# EAGLE design 4T-audio-amp (EAGLE 5.07)
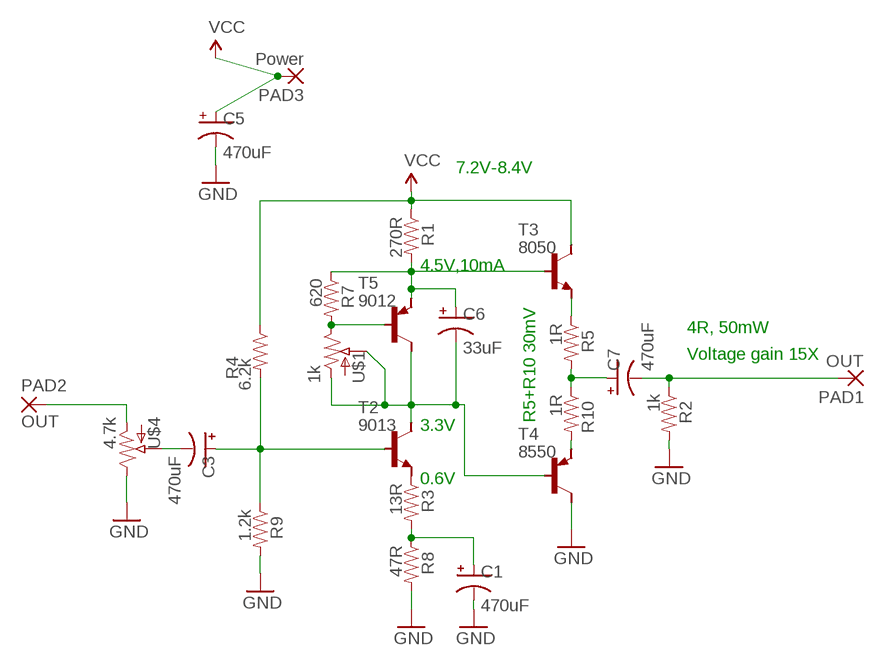
[diagram p0: schematic, sheet 1]

## Parts
C1  470uF  CAP_POLPTH1  [CPOL-RADIAL-100UF-25V]
C3  470uF  CAP_POLPTH1  [CPOL-RADIAL-100UF-25V]
C5  470uF  CAP_POLPTH1  [CPOL-RADIAL-100UF-25V]
C6  33uF  CAP_POLPTH1  [CPOL-RADIAL-100UF-25V]
C7  470uF  CAP_POLPTH1  [CPOL-RADIAL-100UF-25V]
PAD1  OUT  WIREPAD4,16O1,6  [4,16O1,6]
PAD2  OUT  WIREPAD4,16O1,6  [4,16O1,6]
PAD3  Power  WIREPAD4,16O1,6  [4,16O1,6]
R1  270R  RESISTOR0805  [0805]
R2  1k  RESISTOR0805  [0805]
R3  13R  RESISTOR1/4W  [AXIAL-0.3]
R4  6.2k  RESISTOR0805  [0805]
R5  1R  RESISTOR0805  [0805]
R7  620  RESISTOR0805  [0805]
R8  47R  RESISTOR0805  [0805]
R9  1.2k  RESISTOR0805  [0805]
R10  1R  RESISTOR0805  [0805]
T2  9013  -NPN-TO92-EBC  [TO92-EBC]
T3  8050  -NPN-TO92-EBC  [TO92-EBC]
T4  8550  -PNP-TO92-EBC  [TO92-EBC]
T5  9012  -PNP-TO92-EBC  [TO92-EBC]
U$1  1k  POTB25P-3362P  [B25P]
U$4  4.7k  POTPANNEL  [POT-PANNEL]

## Nets
GND: C1.2(-) C5.2(-) R2.2 R8.2 R9.2 T4.C U$4.E
N$1: R10.2 T4.E
N$2: R3.P$1 T2.E
N$3: C6.2(-) T2.C T4.B T5.C U$1.A U$1.S
N$4: C7.1(+) R5.2 R10.1
N$5: R5.1 T3.E
N$6: C1.1(+) R3.P$2 R8.1
N$7: R7.2 T5.B U$1.E
N$8: C6.1(+) R1.2 R7.1 T3.B T5.E
N$9: C7.2(-) PAD1.1(P) R2.1
N$10: C3.1(+) R4.2 R9.1 T2.B
N$11: PAD2.1(P) U$4.A
N$12: C3.2(-) U$4.S
VCC: C5.1(+) PAD3.1(P) R1.1 R4.1 T3.C

## Notes on the sheet
- 7.2V-8.4V
- 4.5V,10mA
- 4R, 50mW
- Voltage gain 15X
- R5+R10 30mV
- 3.3V
- 0.6V

## Library data of the parts
C1 C3 C5-C7 = digital-toy:CAP_POL: Capacitor Polarized These are standard SMD and PTH capacitors. Normally 10uF, 47uF, and 100uF in electrolytic and tantalum varieties. Always verify the external diameter of the through hole cap, it varies with capacity, voltage, and manufacturer. The EIA devices should be standard. PANASONIC_D size: 6.5mmx6.5mmx5.5mm, 100uf (taobao:6.3mmx5.5mm), same as CVL0605 153cvl0405 size: 4mmx4mmx5.5mm, 10uf (taobao:4mmx5.5mm) ct6032 typical 47uF Tantalum, comment by hyl.
PAD1-PAD3 = wirepad:WIREPAD: Wire PAD connect wire on PCB
R1-R5 R7-R10 = digital-toy:RESISTOR: Resistor Basic schematic elements and footprints for 0603, 1206, and PTH 1/10th watt (small) resistors. digital-toy copy vertical mount of axial-0.3 from rcl.lbr : the 0207/xx 3W resistor: 0617/17, 0617/22, 0617V
T2 T3 = digital-toy:*-NPN-: NPN Transistror most of sot-23 use the pacages sot23-BEC, top C, left B, right E. by hyl, digital-toy. and to-92 use ebc(from-top) by hyl, digital-toy.
T4 T5 = digital-toy:*-PNP-: PNP Transistror
U$1 U$4 = digital-toy:POT: POT digital toy POT, 3296 multi turn, blue-white ... hyl 8/07/2001

## Board
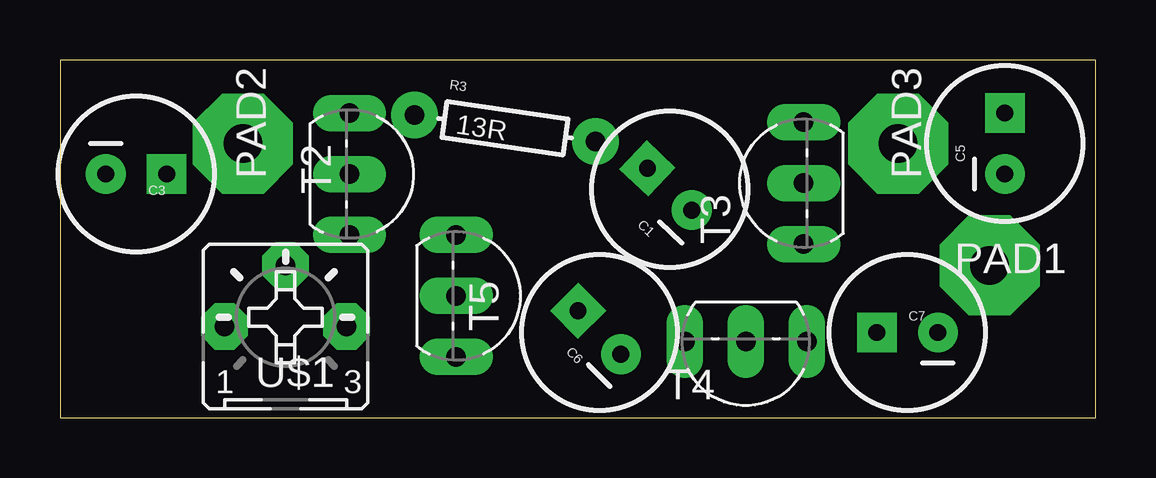
[diagram p1: board, top side]
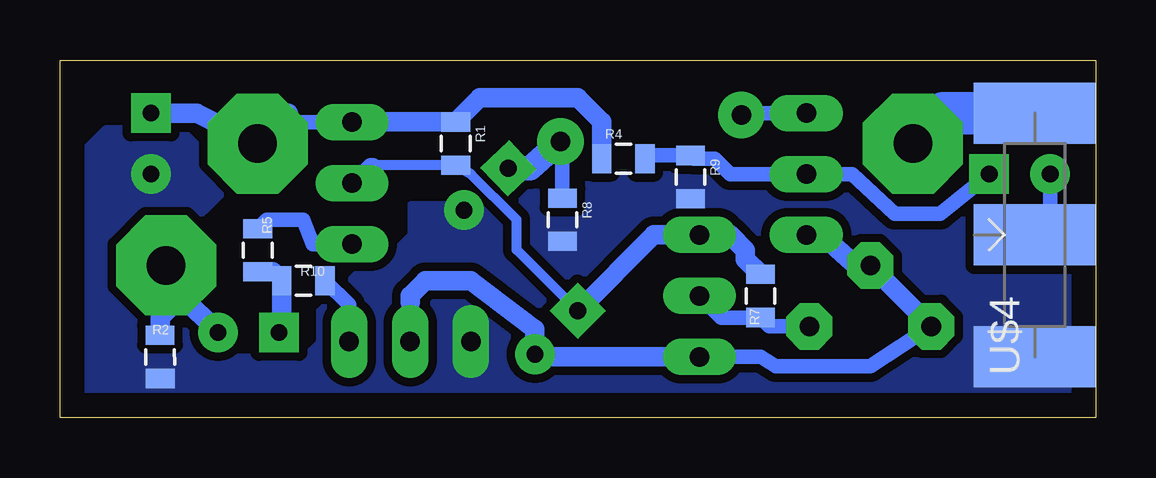
[diagram p2: board, bottom side, seen from below]

Size 43.16 x 14.91 mm. Coordinates in mm from the lower left corner, seen from the top.
Outline: 0,0 43.16,0 43.16,14.91 0,14.91 0,0
Copper layers (1*16): Top 0.035mm / dielectric 1.5mm / Bottom 0.035mm
Design rules "default": minimum track width 10mil, minimum drill 24mil, track to track 8mil, track to pad 8mil, pad to pad 8mil, via to via 8mil, smd to smd 8mil, copper to edge 40mil, drill to drill 8mil, minimum pad ring 10mil, minimum via ring 8mil, stop-mask expansion 4mil, vias tented up to drill 0mil, thermal gap 10mil

### Footprints (pad centres in the part's own frame; a part is rotated, then mirrored left to right if it is on the bottom)
CPOL-RADIAL-100UF-25V = drill 0.7 pad 1.651 square: 1 1.27,0 | drill 0.7 pad 1.651 round: 2 -1.27,0
4,16O1,6 = drill 1.6 pad 4.166 octagon: 1 0,0
0805 = smd 0.8 x 1.2: 1 -0.9,0; 2 0.9,0
AXIAL-0.3 = drill 0.813 pad 1.93 round: P$1 -3.81,0; P$2 3.81,0
TO92-EBC = drill 0.813 pad 1.524 long: B 0,-1.27; C 2.54,-1.27; E -2.54,-1.27
B25P = drill 0.813 pad 1.93 octagon: A -2.54,0; E 2.54,0; S 0,2.54
POT-PANNEL = smd 2.54 x 5.08: A -6.35,0; E 3.81,0; S -1.27,0

### Placement (x,y rotation side)
C1  25.4,9.53 136.6 top
C3  3.17,10.16 0 top
C5  39.37,11.43 90 top
C6  22.48,3.56 134.6 top
C7  35.31,3.56 180 top
PAD1  38.73,6.35 0 top
PAD2  7.62,11.43 0 top
PAD3  34.92,11.43 0 top
R1  26.67,11.43 270 bottom
R2  38.99,2.54 270.2 bottom
R3  18.54,12.06 351.7 top
R4  19.68,10.79 0 bottom
R5  34.92,6.99 270 bottom
R7  13.97,5.08 270 bottom
R8  22.23,8.26 270 bottom
R9  16.89,10.03 270 bottom
R10  33.02,5.71 0 bottom
T2  13.34,10.16 270 top
T3  29.72,9.78 90 top
T4  28.57,1.91 180 top
T5  17.78,5.08 270 top
U$1  9.4,3.81 0 top
U$4  2.54,6.35 270 bottom

### Tracks (layer width: path | path; a pad name or v marks a point on that pad's centre or on a via)
GND
  pour Bottom (isolate 0.356, no thermals): -2.54,7.62 5.08,7.62 5.71,8.89 9.53,8.89 10.79,10.16 22.86,10.16 24.13,8.89 28.57,8.89 28.57,7.62 29.84,6.35 30.48,6.35 32.38,4.45 32.38,3.17 33.02,2.54 36.83,2.54 38.1,3.81 38.1,7.62 36.2,9.53 36.2,10.16 38.1,12.06 41.27,12.06 45.09,8.26 45.09,1.27 41.91,-1.91 -0.64,-1.91 -2.54,0
N$1
  Bottom 0.61: T4.E 31.11,4.71 R10.2
N$2
  Bottom 0.61: T2.E 14.85,12.7 R3.P$1
N$3
  Bottom 0.254: 23.26,2.54 C6.2
  Bottom 0.61: T5.C 13.97,2.54 13.34,2.16 9.4,2.16 U$1.A | 28.57,4.83 T4.B
  Bottom 0.813: T2.C 11.43,7.62 10.16,6.48 U$1.S U$1.A | T5.C 23.26,2.54 | C6.2 23.37,3.69 26.04,5.71 27.94,5.71 28.57,5.08 28.57,4.83
N$4
  Bottom 0.254: R10.1 34.29,6.08
  Bottom 0.813: 34.29,6.08 R5.2 | R10.1 33.92,4.31 C7.1
N$5
  Bottom 0.61: T3.E 32.64,7.24 33.02,8.26 34.55,8.26 R5.1
N$6
  Bottom 0.61: R8.1 22.23,10.79 R3.P$2
  Bottom 1.016: C1.1 23.56,10.4 R3.P$2
N$7
  Bottom 0.61: U$1.E 13.6,3.81 R7.2 15.61,4.18 T5.B
N$8
  Bottom 0.254: 21.57,4.46 C6.1
  Bottom 0.406: C6.1 24.13,7 24.13,8.26 26.04,10.16 R1.2 30.11,10.53
  Bottom 0.61: 30.11,10.53 30.24,10.53 T3.B
  Bottom 0.813: 21.57,4.46 18.41,7.62 T5.E 15.24,7.62 14.61,6.99 14.61,6.62 R7.1
N$9
  Bottom 0.813: C7.2 38.1,5.08 | 38.1,5.08 PAD1.1 | R2.1 38.99,4.19 38.1,5.08
N$10
  Bottom 0.254: 16.75,10.79 R9.1 | 18.65,10.93 R4.2
  Bottom 0.61: C3.1 6.48,8.51 8.38,8.51 10.16,10.16 T2.B 15.24,10.16 15.88,10.79 16.75,10.79 | R9.1 18.65,10.93
N$11
  Bottom 1.778: U$4.A 6.35,12.7 PAD2.1
N$12
  Bottom 0.254: 1.91,8.89 U$4.S
  Bottom 0.61: 1.91,8.89 C3.2
VCC
  Bottom 0.61: 30.11,12.33 T3.C 33.66,12.32 33.66,12.7
  Bottom 0.813: C5.1 37.47,12.7 PAD3.1 33.66,12.7 | 30.11,12.33 R1.1 25.66,13.34 21.59,13.34 20.59,12.33 R4.1